# EAGLE design HacklabBlinker (EAGLE 5.10)
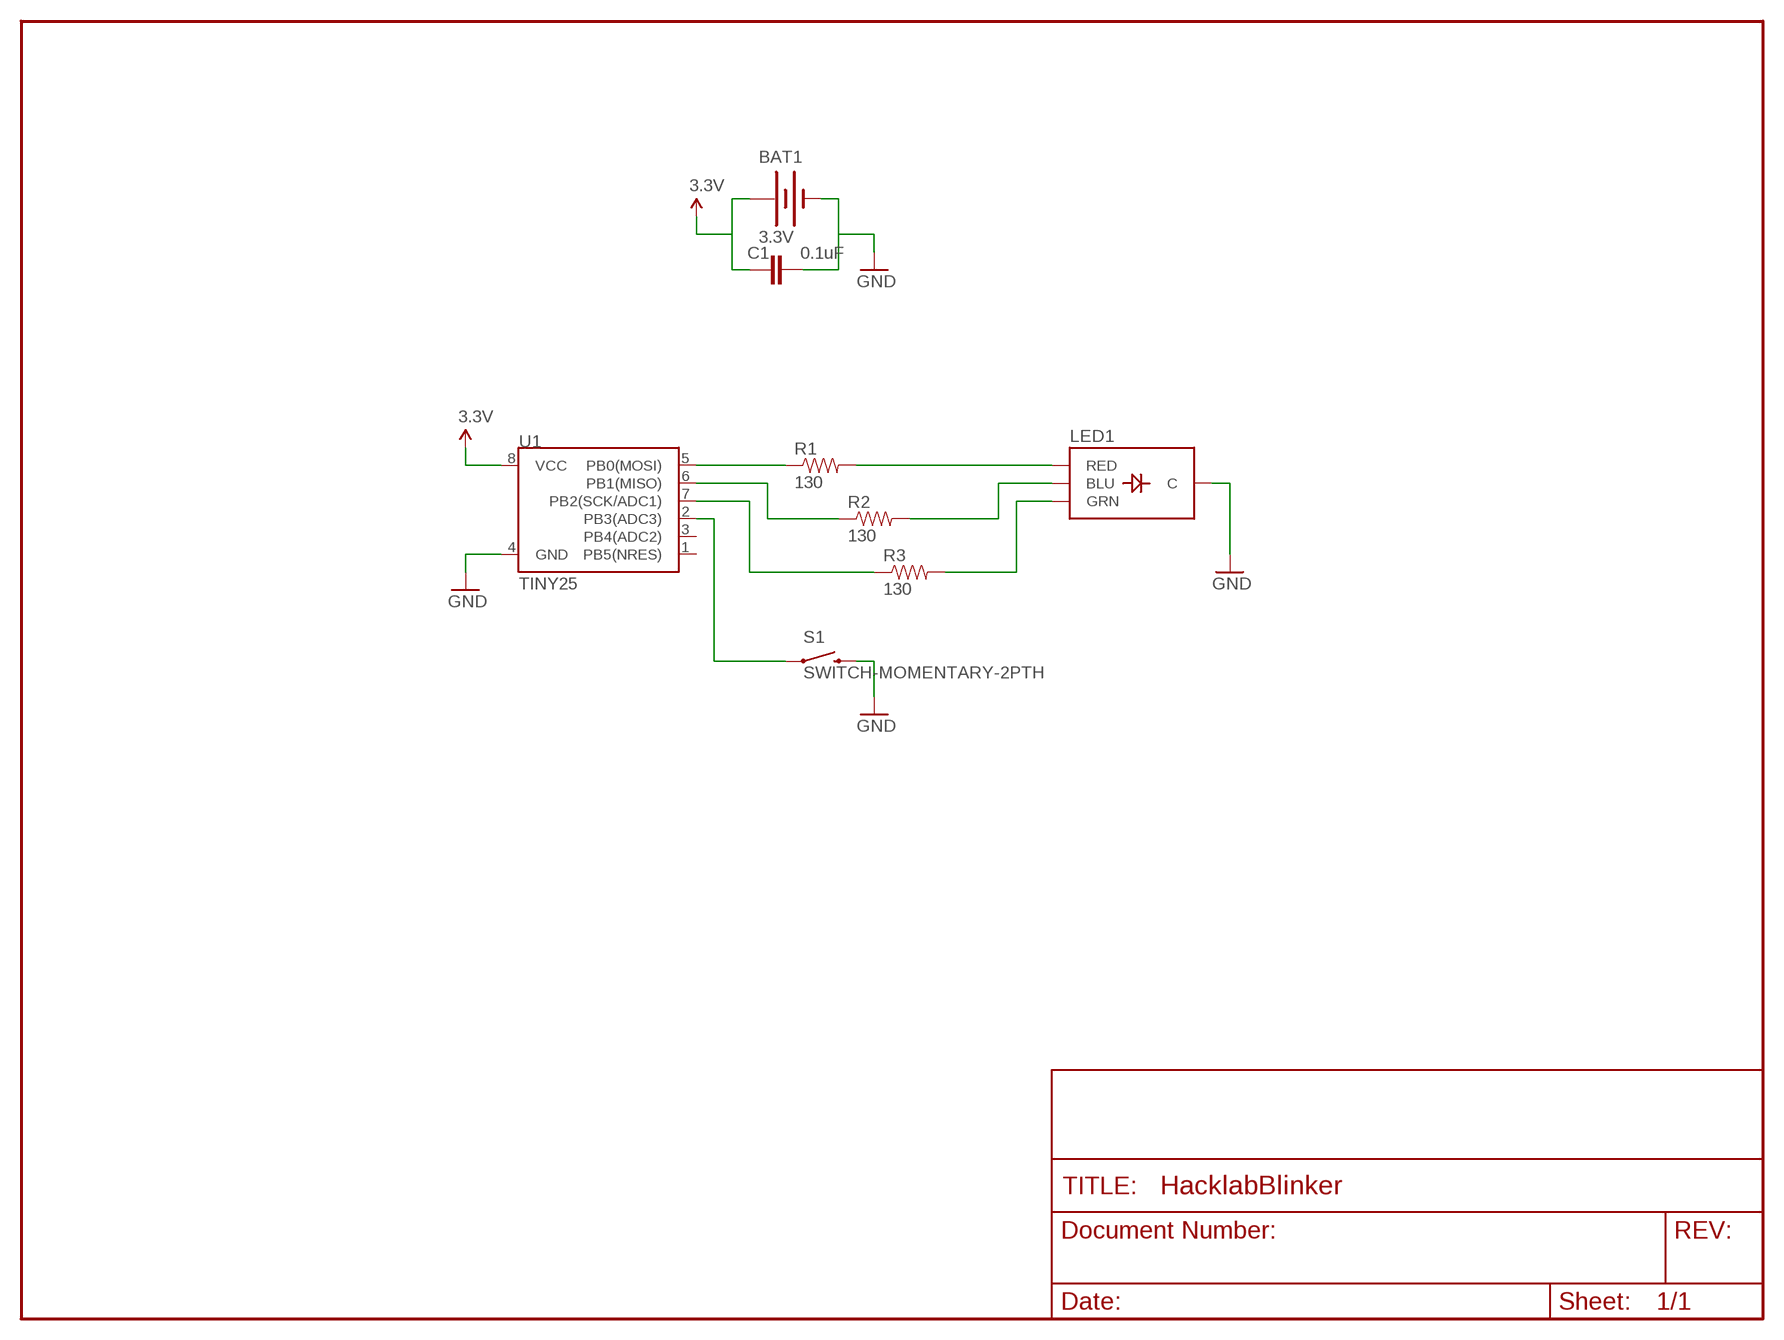
[diagram p0: schematic, sheet 1]

## Parts
BAT1  3.3V  BATTERY20PTH  [BATTCOM_20MM_PTH]
C1  0.1uF  CAPPTH  [CAP-PTH-SMALL]
LED1  LED-TRICOLOR-THROUGHHOLE  [LED-TRICOLOR-THROUGHHOLE]
R1  130  RESISTORPTH-1/4W  [AXIAL-0.4]
R2  130  RESISTORPTH-1/4W  [AXIAL-0.4]
R3  130  RESISTORPTH-1/4W  [AXIAL-0.4]
S1  SWITCH-MOMENTARY-2PTH  [TACTILE-PTH]
U1  TINY25  ATTINY45DIP8  [DIP08]

## Nets
3.3V: BAT1.1(+) C1.1 U1.8(VCC)
GND: BAT1.2(-) C1.2 LED1.GND(C) S1.3 U1.4(GND)
N$1: R1.P$1 U1.5(PB0(MOSI))
N$2: R2.P$1 U1.6(PB1(MISO))
N$3: R3.P$1 U1.7(PB2(SCK/ADC1))
N$4: LED1.RED R1.P$2
N$5: LED1.BLU R2.P$2
N$6: LED1.GRN R3.P$2
N$10: S1.1 U1.2(PB3(ADC3))
Unconnected: U1.1(PB5(NRES)) U1.3(PB4(ADC2))

## Library data of the parts
BAT1 = SparkFun:BATTERY: Battery Holders Various common sizes : AA, AAA, 20mm coin cell and 12mm coin cell.
C1 = SparkFun:CAP: Capacitor Standard 0603 ceramic capacitor, and 0.1" leaded capacitor.
LED1 = SparkFun:LED-TRICOLOR-THROUGHHOLE
R1-R3 = SparkFun:RESISTOR: Resistor Basic schematic elements and footprints for 0603, 1206, and PTH resistors.
S1 = SparkFun:SWITCH-MOMENTARY-2
U1 = SparkFun:ATTINY45: Atmel ATTiny45

## Board
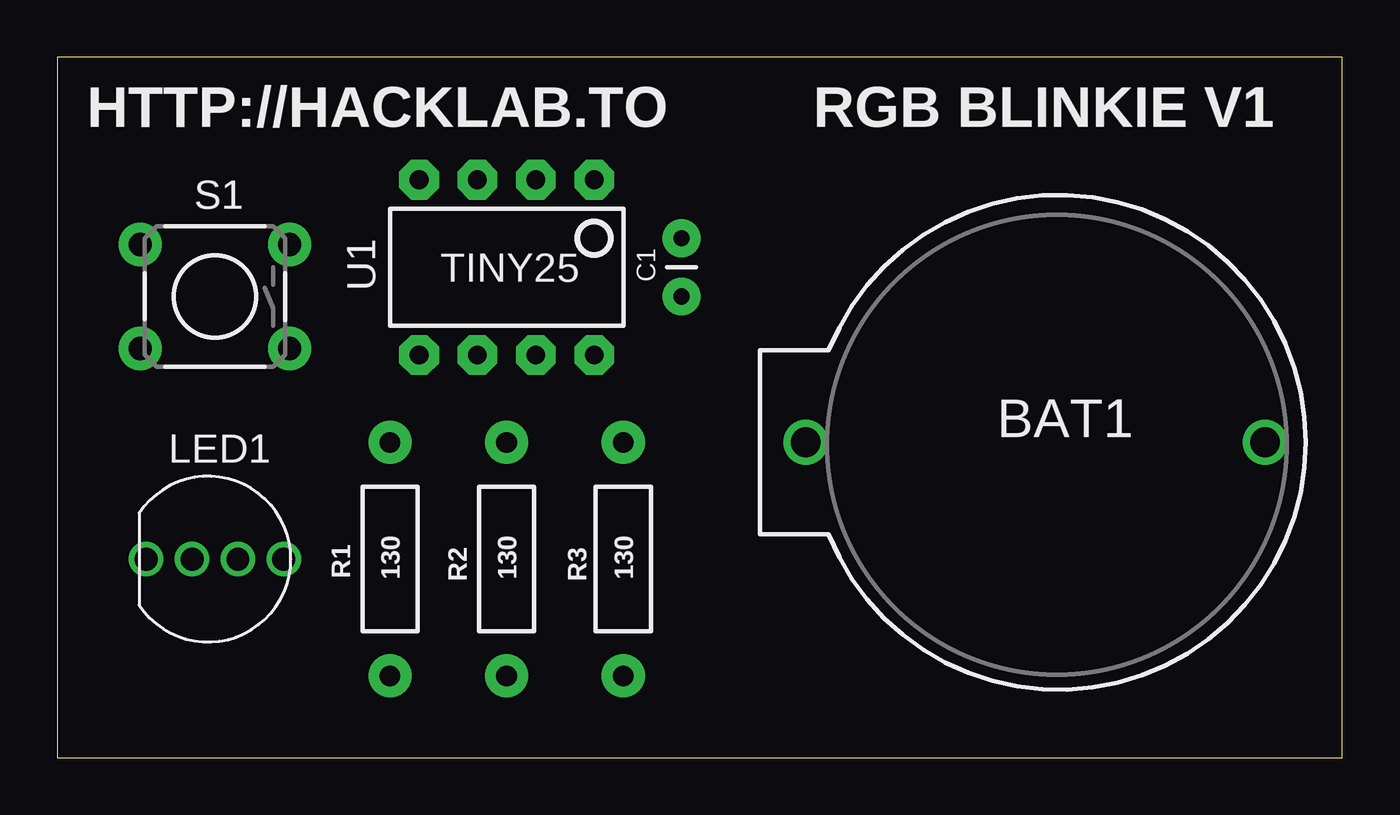
[diagram p1: board, top side]
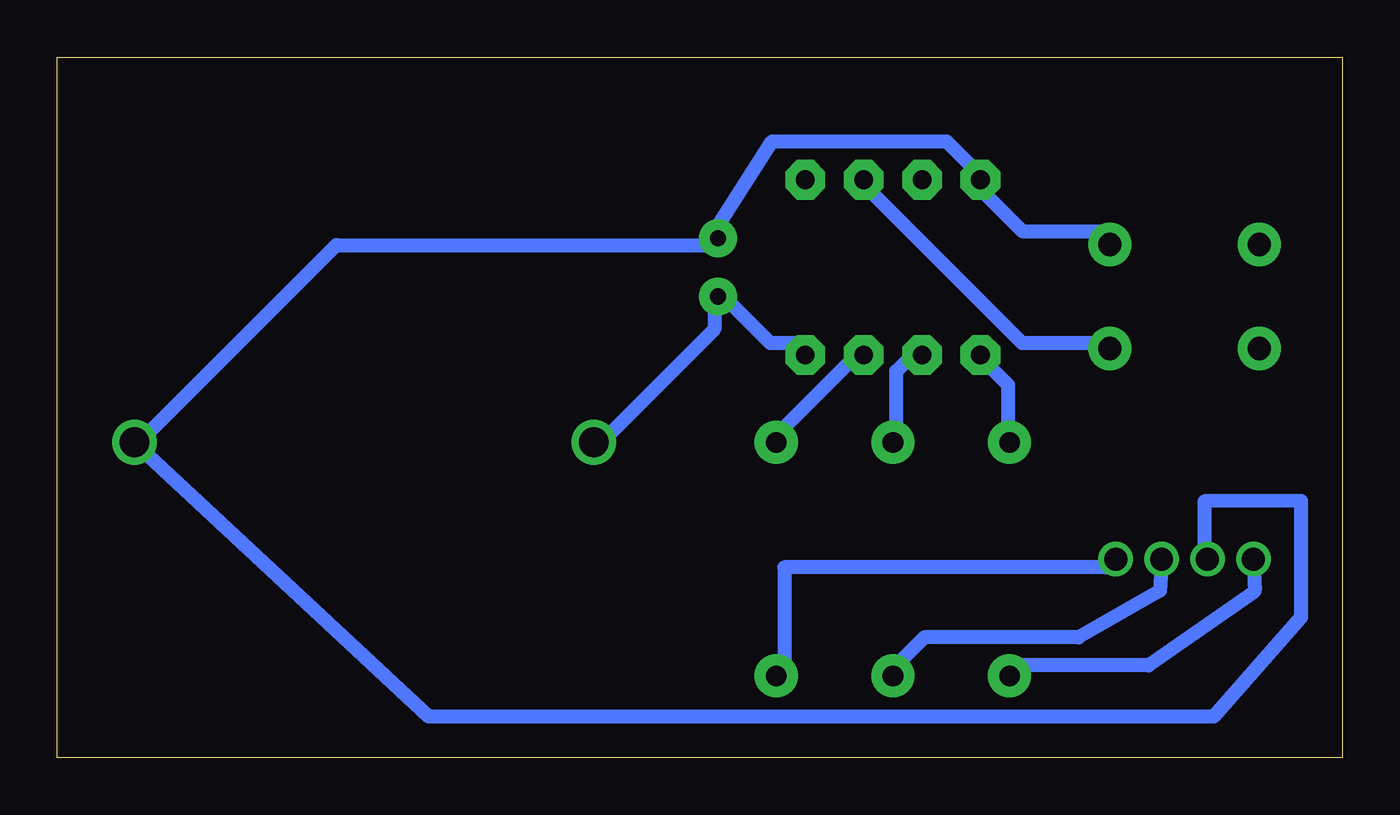
[diagram p2: board, bottom side, seen from below]

Size 55.93 x 30.47 mm. Coordinates in mm from the lower left corner, seen from the top.
Outline: 0,0 55.93,0 55.93,30.47 0,30.47 0,0
Copper layers (1*16): Top 0.035mm / dielectric 1.5mm / Bottom 0.035mm
Design rules "default": minimum track width 10mil, minimum drill 24mil, track to track 8mil, track to pad 8mil, pad to pad 8mil, via to via 8mil, smd to smd 8mil, copper to edge 40mil, drill to drill 8mil, minimum pad ring 10mil, minimum via ring 8mil, stop-mask expansion 4mil, vias tented up to drill 0mil, thermal gap 10mil

### Footprints (pad centres in the part's own frame; a part is rotated, then mirrored left to right if it is on the bottom)
BATTCOM_20MM_PTH = drill 1.3 round: 1 20,0; 2 0,0
CAP-PTH-SMALL = drill 0.7 pad 1.651 round: 1 0,0; 2 2.54,0
LED-TRICOLOR-THROUGHHOLE = drill 1 round: BLU 1,0; GND -1,0; GRN 3,0; RED -3,0
AXIAL-0.4 = drill 0.9 pad 1.88 round: P$1 -5.08,0; P$2 5.08,0
TACTILE-PTH = drill 1.016 pad 1.88 round: 1 -3.251,2.261; 2 3.251,2.261; 3 -3.251,-2.261; 4 3.251,-2.261
DIP08 = drill 0.813 pad 1.727 octagon: 1 -3.81,-3.81; 2 -1.27,-3.81; 3 1.27,-3.81; 4 3.81,-3.81; 5 3.81,3.81; 6 1.27,3.81; 7 -1.27,3.81; 8 -3.81,3.81

### Placement (x,y rotation side)
BAT1  52.58,13.72 180 top
C1  27.18,20.07 90 top
LED1  6.86,8.64 0 top
R1  14.48,8.64 270 top
R2  19.56,8.64 270 top
R3  24.64,8.64 270 top
S1  6.86,20.07 180 top
U1  19.56,21.34 180 top

### Tracks (layer width: path | path; a pad name or v marks a point on that pad's centre or on a via)
3.3V
  Bottom 0.254: C1.1 27.33,19.86
  Bottom 0.61: C1.1 26.72,19.86 24.89,18.03 23.67,18.03 U1.8 | 27.33,19.86 27.33,18.64 32.21,13.77 BAT1.1
GND
  Bottom 0.254: BAT1.2 52.32,13.77 | 27.33,22.3 C1.2 | 10.26,22.91 10.11,22.91 | 15.75,25.35 U1.4
  Bottom 0.61: 52.32,13.77 43.79,22.3 27.33,22.3 | BAT1.2 39.75,1.78 5.59,1.78 1.78,6.1 1.78,11.18 5.99,11.15 5.99,8.89 LED1.GND | C1.2 27.33,22.91 24.82,26.82 17.22,26.82 15.75,25.35 | 10.11,22.91 S1.3 10.26,22.91 13.92,22.91 15.75,24.74 U1.4
N$1
  Bottom 0.254: U1.5 15.75,17.48 | R1.P$1 14.53,13.77
  Bottom 0.61: 14.53,13.77 14.53,16.2 15.75,17.42 U1.5
N$2
  Bottom 0.254: R2.P$1 19.41,13.77
  Bottom 0.61: 19.41,13.77 19.41,16.82 18.8,17.42 U1.6
N$3
  Bottom 0.61: U1.7 21.23,17.42 24.28,14.38 24.28,13.77 R3.P$1
N$4
  Bottom 0.61: LED1.RED 3.81,7.24 8.43,4.01 13.92,4.01 R1.P$2
N$5
  Bottom 0.61: LED1.BLU 7.92,7.26 11.48,5.23 18.19,5.23 19.41,4.01 R2.P$2
N$6
  Bottom 0.61: LED1.GRN 10.26,8.28 24.28,8.28 24.28,4.01 R3.P$2
N$10
  Bottom 0.61: U1.2 20.62,24.74 13.92,18.03 10.26,18.03 S1.1

### Text on the board
tPlace: HTTP://HACKLAB.TO | RGB BLINKIE V1